# Altium project Sayma_mezzanine.PrjPCB
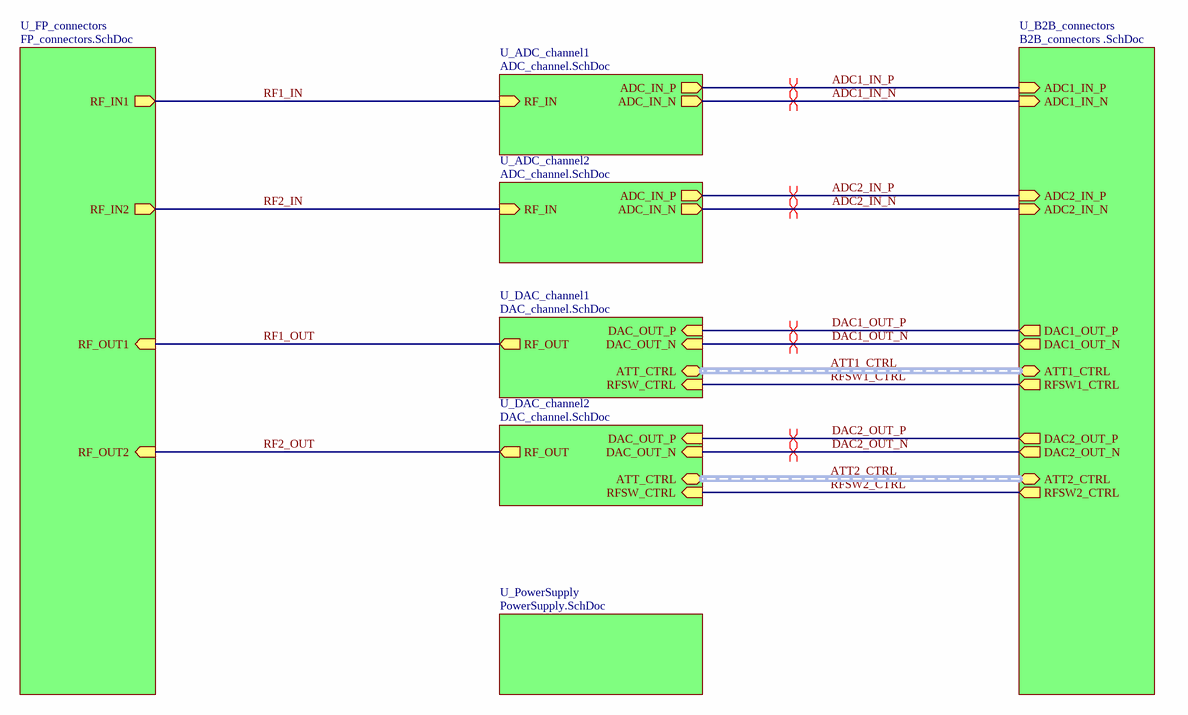
[diagram p0: Sayma_mezz_top.SchDoc]
7 sheets, 41 parts. Net scope: hierarchical (ports join the sheet entries above them; power ports are global).
Sheets:
  Sayma_mezz_top.SchDoc
    U_DAC_channel1 = DAC_channel.SchDoc
      U_Amplifier = Amplifier.SchDoc
      U_DAC_Filter = DAC_Filter.SchDoc
    U_DAC_channel2 = DAC_channel.SchDoc
      U_Amplifier = Amplifier.SchDoc
      U_DAC_Filter = DAC_Filter.SchDoc
    U_B2B_connectors = B2B_connectors .SchDoc
  ADC_Buffer.SchDoc
  ADC_Filter.SchDoc

## Sheet Sayma_mezz_top.SchDoc: =ProjectName
size 420 x 297 mm; Author: SBH; CompanyName: WUT; DrawnBy: SBH; Organization: ISE-WUT; Address1: Warsaw Univeristy of Technology; Address2: Nowowiejska 15/19; Revision: -; SheetNumber: -; SheetTotal: -; EDA_Number: ARTIQ; Projet: Sayma_Mezzanine; ModifiedBy: -; CreateDate: XX/XX/XXXX; CheckedDate: -; Title2: Sayma_mezz_top.SchDoc; DivGrp: ISE; Designer: SBH; ModifiedDate: -; ProjectName: Sayma_Mezzanine

### Sub-sheets
U_ADC_channel1 = ADC_channel.SchDoc (file not in this document): ADC_IN_N (out), ADC_IN_P (out), RF_IN (in)
U_ADC_channel2 = ADC_channel.SchDoc (file not in this document): ADC_IN_P (out), ADC_IN_N (out), RF_IN (in)
U_B2B_connectors = B2B_connectors .SchDoc: ADC1_IN_N (in), ADC1_IN_P (in), DAC1_OUT_N (out), DAC1_OUT_P (out), DAC2_OUT_N (out), DAC2_OUT_P (out), ADC2_IN_N (in), ADC2_IN_P (in), ATT1_CTRL (harness ATT_CTRL), ATT2_CTRL (harness ATT_CTRL), RFSW1_CTRL (out), RFSW2_CTRL (out)
U_DAC_channel1 = DAC_channel.SchDoc: DAC_OUT_P (in), DAC_OUT_N (in), RF_OUT (out), ATT_CTRL (harness ATT_CTRL), RFSW_CTRL (in)
U_DAC_channel2 = DAC_channel.SchDoc: DAC_OUT_P (in), DAC_OUT_N (in), RF_OUT (out), RFSW_CTRL (in), ATT_CTRL (harness ATT_CTRL)
U_FP_connectors = FP_connectors.SchDoc (file not in this document): RF_IN1 (out), RF_IN2 (out), RF_OUT1 (in), RF_OUT2 (in)
U_PowerSupply = PowerSupply.SchDoc (file not in this document): no entries

### Nets
ADC1_IN_N: sheet U_ADC_channel1/ADC_IN_N, sheet U_B2B_connectors/ADC1_IN_N
ADC1_IN_P: sheet U_ADC_channel1/ADC_IN_P, sheet U_B2B_connectors/ADC1_IN_P
ADC2_IN_N: sheet U_ADC_channel2/ADC_IN_N, sheet U_B2B_connectors/ADC2_IN_N
ADC2_IN_P: sheet U_ADC_channel2/ADC_IN_P, sheet U_B2B_connectors/ADC2_IN_P
DAC1_OUT_N: sheet U_DAC_channel1/DAC_OUT_N, sheet U_B2B_connectors/DAC1_OUT_N
DAC1_OUT_P: sheet U_DAC_channel1/DAC_OUT_P, sheet U_B2B_connectors/DAC1_OUT_P
DAC2_OUT_N: sheet U_DAC_channel2/DAC_OUT_N, sheet U_B2B_connectors/DAC2_OUT_N
DAC2_OUT_P: sheet U_DAC_channel2/DAC_OUT_P, sheet U_B2B_connectors/DAC2_OUT_P
RF1_IN: sheet U_ADC_channel1/RF_IN, sheet U_FP_connectors/RF_IN1
RF1_OUT: sheet U_DAC_channel1/RF_OUT, sheet U_FP_connectors/RF_OUT1
RF2_IN: sheet U_ADC_channel2/RF_IN, sheet U_FP_connectors/RF_IN2
RF2_OUT: sheet U_DAC_channel2/RF_OUT, sheet U_FP_connectors/RF_OUT2
RFSW1_CTRL: sheet U_DAC_channel1/RFSW_CTRL, sheet U_B2B_connectors/RFSW1_CTRL
RFSW2_CTRL: sheet U_DAC_channel2/RFSW_CTRL, sheet U_B2B_connectors/RFSW2_CTRL

### Buses and harness runs
harness ATT1_CTRL = sheet U_B2B_connectors/ATT1_CTRL = sheet U_DAC_channel1/ATT_CTRL
harness ATT2_CTRL = sheet U_B2B_connectors/ATT2_CTRL = sheet U_DAC_channel2/ATT_CTRL

### Layout directives
differential pair: ADC1_IN_N, ADC1_IN_P, ADC2_IN_N, ADC2_IN_P, DAC1_OUT_N, DAC1_OUT_P, DAC2_OUT_N, DAC2_OUT_P

### Notes on the sheet
- Project/Equipment
- Designer
- Drawn by
- Check.by
- File
- Last Mod.
- Print Date
- Sheet
- Size
- A3
- of
- Rev

## Sheet DAC_channel.SchDoc: =ProjectName
size 420 x 297 mm; Author: SBH; CompanyName: WUT; DrawnBy: SBH; Organization: ISE-WUT; Address1: Warsaw Univeristy of Technology; Address2: Nowowiejska 15/19; Revision: -; SheetNumber: -; SheetTotal: -; EDA_Number: ARTIQ; Projet: ADC/DAC MEZZANINE; ModifiedBy: -; CreateDate: XX/XX/XXXX; CheckedDate: -; Title2: DAC_channel.SchDoc; DivGrp: ISE; Designer: SBH; ModifiedDate: -; ProjectName: ADC/DAC MEZZANINE
Used 2 times, as channels U_DAC_channel1, U_DAC_channel2. Parts and nets are listed once, with the designators drawn on the sheet.
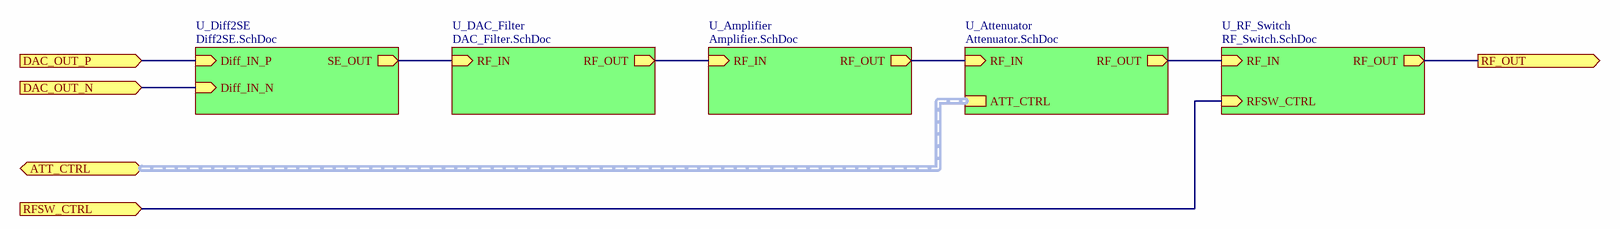
[diagram p1: DAC_channel.SchDoc]

### Sub-sheets
U_Amplifier = Amplifier.SchDoc: RF_IN (in), RF_OUT (out)
U_Attenuator = Attenuator.SchDoc (file not in this document): RF_IN (in), RF_OUT (out), ATT_CTRL (harness ATT_CTRL)
U_DAC_Filter = DAC_Filter.SchDoc: RF_IN (in), RF_OUT (out)
U_Diff2SE = Diff2SE.SchDoc (file not in this document): Diff_IN_P (in), Diff_IN_N (in), SE_OUT (out)
U_RF_Switch = RF_Switch.SchDoc (file not in this document): RF_IN (in), RF_OUT (out), RFSW_CTRL (in)

### Ports
ATT_CTRL (harness ATT_CTRL), DAC_OUT_N (in), DAC_OUT_P (in), RF_OUT (out), RFSW_CTRL (in)

### Nets
DAC_OUT_N: port DAC_OUT_N, sheet U_Diff2SE/Diff_IN_N
DAC_OUT_P: port DAC_OUT_P, sheet U_Diff2SE/Diff_IN_P
RF_OUT: port RF_OUT, sheet U_RF_Switch/RF_OUT
RFSW_CTRL: port RFSW_CTRL, sheet U_RF_Switch/RFSW_CTRL
(unnamed): sheet U_Diff2SE/SE_OUT, sheet U_DAC_Filter/RF_IN
(unnamed): sheet U_Amplifier/RF_IN, sheet U_DAC_Filter/RF_OUT
(unnamed): sheet U_Amplifier/RF_OUT, sheet U_Attenuator/RF_IN
(unnamed): sheet U_Attenuator/RF_OUT, sheet U_RF_Switch/RF_IN

### Channels
U_DAC_channel1: ports DAC_OUT_N=DAC1_OUT_N DAC_OUT_P=DAC1_OUT_P RF_OUT=RF1_OUT RFSW_CTRL=RFSW1_CTRL
U_DAC_channel2: ports DAC_OUT_N=DAC2_OUT_N DAC_OUT_P=DAC2_OUT_P RF_OUT=RF2_OUT RFSW_CTRL=RFSW2_CTRL

### Buses and harness runs
harness port ATT_CTRL = sheet U_Attenuator/ATT_CTRL

### Notes on the sheet
- Project/Equipment
- Designer
- Drawn by
- Check.by
- File
- Last Mod.
- Print Date
- Sheet
- Size
- A3
- of
- Rev

## Sheet Amplifier.SchDoc: =ProjectName
size 420 x 297 mm; Author: SBH; CompanyName: WUT; DrawnBy: SBH; Organization: ISE-WUT; Address1: Warsaw Univeristy of Technology; Address2: Nowowiejska 15/19; Revision: -; SheetNumber: -; SheetTotal: -; EDA_Number: ARTIQ; Projet: ADC/DAC MEZZANINE; ModifiedBy: -; CreateDate: XX/XX/XXXX; CheckedDate: -; Title2: Amplifier.SchDoc; DivGrp: ISE; Designer: SBH; ModifiedDate: -; ProjectName: ADC/DAC MEZZANINE
Used 2 times, as channels U_DAC_channel1/U_Amplifier, U_DAC_channel2/U_Amplifier. Parts and nets are listed once, with the designators drawn on the sheet.
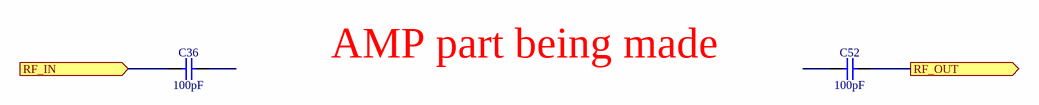
[diagram p2: Amplifier.SchDoc]

### Parts
C36  100pF  [CAPC1005X55N]
C52  100pF  [CAPC1005X55N]

### Ports
RF_IN (in), RF_OUT (out)

### Nets
RF_IN: C36.2 ; port RF_IN
RF_OUT: C52.1 ; port RF_OUT

Not connected (* = marked no-connect by the designer): C36 1; C52 2

### Channels
U_DAC_channel1/U_Amplifier: designators end in A; ports RF_IN=NetC36A_2 RF_OUT=NetC52A_1
U_DAC_channel2/U_Amplifier: designators end in B; ports RF_IN=NetC36B_2 RF_OUT=NetC52B_1

### Notes on the sheet
- AMP part being made
- Project/Equipment
- Designer
- Drawn by
- Check.by
- File
- Last Mod.
- Print Date
- Sheet
- Size
- A3
- of
- Rev

### Library data of the parts
C36 C52 = CC0402_100PF_50V_5%_C0G: Non-polarised capacitor; Part Description: SMD Multilayer Chip Ceramic Capacitor; Manufacturer: GENERIC; Manufacturer1 Part Number: C0402C101J5GACTU; Voltage: 50V; TC: C0G/NP0; Tolerance: ±5%; Part Number: CC0402_100PF_50V_5%_C0G; Component Kind: Standard; Component Type: Standard; Pin Count: 2; Value: 100pF; Status: Preferred; Manufacturer Part Number: CC0402_100PF_50V_5%_C0G; Case: 0402; Mounted: Yes; Socket: No; SMD: Yes; Sense: No; Manufacturer1 Example: KEMET; Manufacturer1 ComponentHeight: 0.55mm; HelpURL: \\cern.ch\dfs\Applications\Altium\Datasheets\CC0805_C0G_KEMET_(Commercial Grade).pdf; Author: CERN DEM JLC; CreateDate: 2007-12-03; LatestRevisionDate: 2015-04-22

## Sheet DAC_Filter.SchDoc: =ProjectName
size 420 x 297 mm; Author: SBH; CompanyName: WUT; DrawnBy: SBH; Organization: ISE-WUT; Address1: Warsaw Univeristy of Technology; Address2: Nowowiejska 15/19; Revision: -; SheetNumber: -; SheetTotal: -; EDA_Number: ARTIQ; Projet: ADC/DAC MEZZANINE; ModifiedBy: -; CreateDate: XX/XX/XXXX; CheckedDate: -; Title2: DAC_Filter.SchDoc; DivGrp: ISE; Designer: SBH; ModifiedDate: -; ProjectName: ADC/DAC MEZZANINE
Used 2 times, as channels U_DAC_channel1/U_DAC_Filter, U_DAC_channel2/U_DAC_Filter. Parts and nets are listed once, with the designators drawn on the sheet.
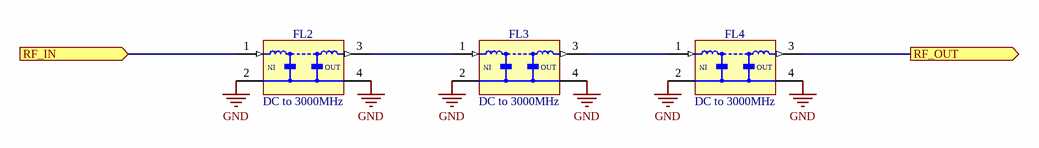
[diagram p3: DAC_Filter.SchDoc]

### Parts
FL2  DC to 3000MHz  [FIL_MINI-CIRCUITS_FV1206]
FL3  DC to 3000MHz  [FIL_MINI-CIRCUITS_FV1206]
FL4  DC to 3000MHz  [FIL_MINI-CIRCUITS_FV1206]

### Ports
RF_IN (in), RF_OUT (out)

### Nets
GND: FL2.2(GND) FL2.4(GND) FL3.2(GND) FL3.4(GND) FL4.2(GND) FL4.4(GND)
RF_IN: FL2.1(RFIN) ; port RF_IN
RF_OUT: FL4.3(RFOUT) ; port RF_OUT
NetFL2_3: FL2.3(RFOUT) FL3.1(RFIN)
NetFL3_3: FL3.3(RFOUT) FL4.1(RFIN)

### Channels
U_DAC_channel1/U_DAC_Filter: designators end in A; ports RF_IN=NetFL2A_1 RF_OUT=NetC36A_2
U_DAC_channel2/U_DAC_Filter: designators end in B; ports RF_IN=NetFL2B_1 RF_OUT=NetC36B_2

### Notes on the sheet
- Project/Equipment
- Designer
- Drawn by
- Check.by
- File
- Last Mod.
- Print Date
- Sheet
- Size
- A3
- of
- Rev
- (in symbol FIL_MINI-CIRCUITS_LFCN-3000+) IN; OUT

### Library data of the parts
FL2-FL4 = FIL_MINI-CIRCUITS_LFCN-3000+: 50 Ohm DC to 3000MHz Low Pass Filter; Part Description: 50 Ohm Low Pass Filter; Part Number: FIL_MINI-CIRCUITS_LFCN-3000+; Component Kind: Standard; Component Type: Standard; Pin Count: 2; Value: DC to 3000MHz; Status: None; Manufacturer: MINI-CIRCUITS; Manufacturer Part Number: LFCN-3000+; Mounted: Yes; Socket: No; SMD: Yes; Sense: No; ComponentHeight: 0.94mm; HelpURL: \\cern.ch\dfs\Applications\Altium\Datasheets\FIL_MINI-CIRCUITS_LFCN-3000+.pdf; Author: CERN DEM JLC; CreateDate: 2013-12-09; LatestRevisionDate: 2013-12-09

## Sheet B2B_connectors .SchDoc: =ProjectName
size 420 x 297 mm; Author: SBH; CompanyName: WUT; DrawnBy: SBH; Organization: ISE-WUT; Address1: Warsaw Univeristy of Technology; Address2: Nowowiejska 15/19; Revision: -; SheetNumber: -; SheetTotal: -; EDA_Number: ARTIQ; Projet: ADC/DAC MEZZANINE; ModifiedBy: -; CreateDate: XX/XX/XXXX; CheckedDate: -; Title2: B2B_connectors .SchDoc; DivGrp: ISE; Designer: SBH; ModifiedDate: -; ProjectName: ADC/DAC MEZZANINE
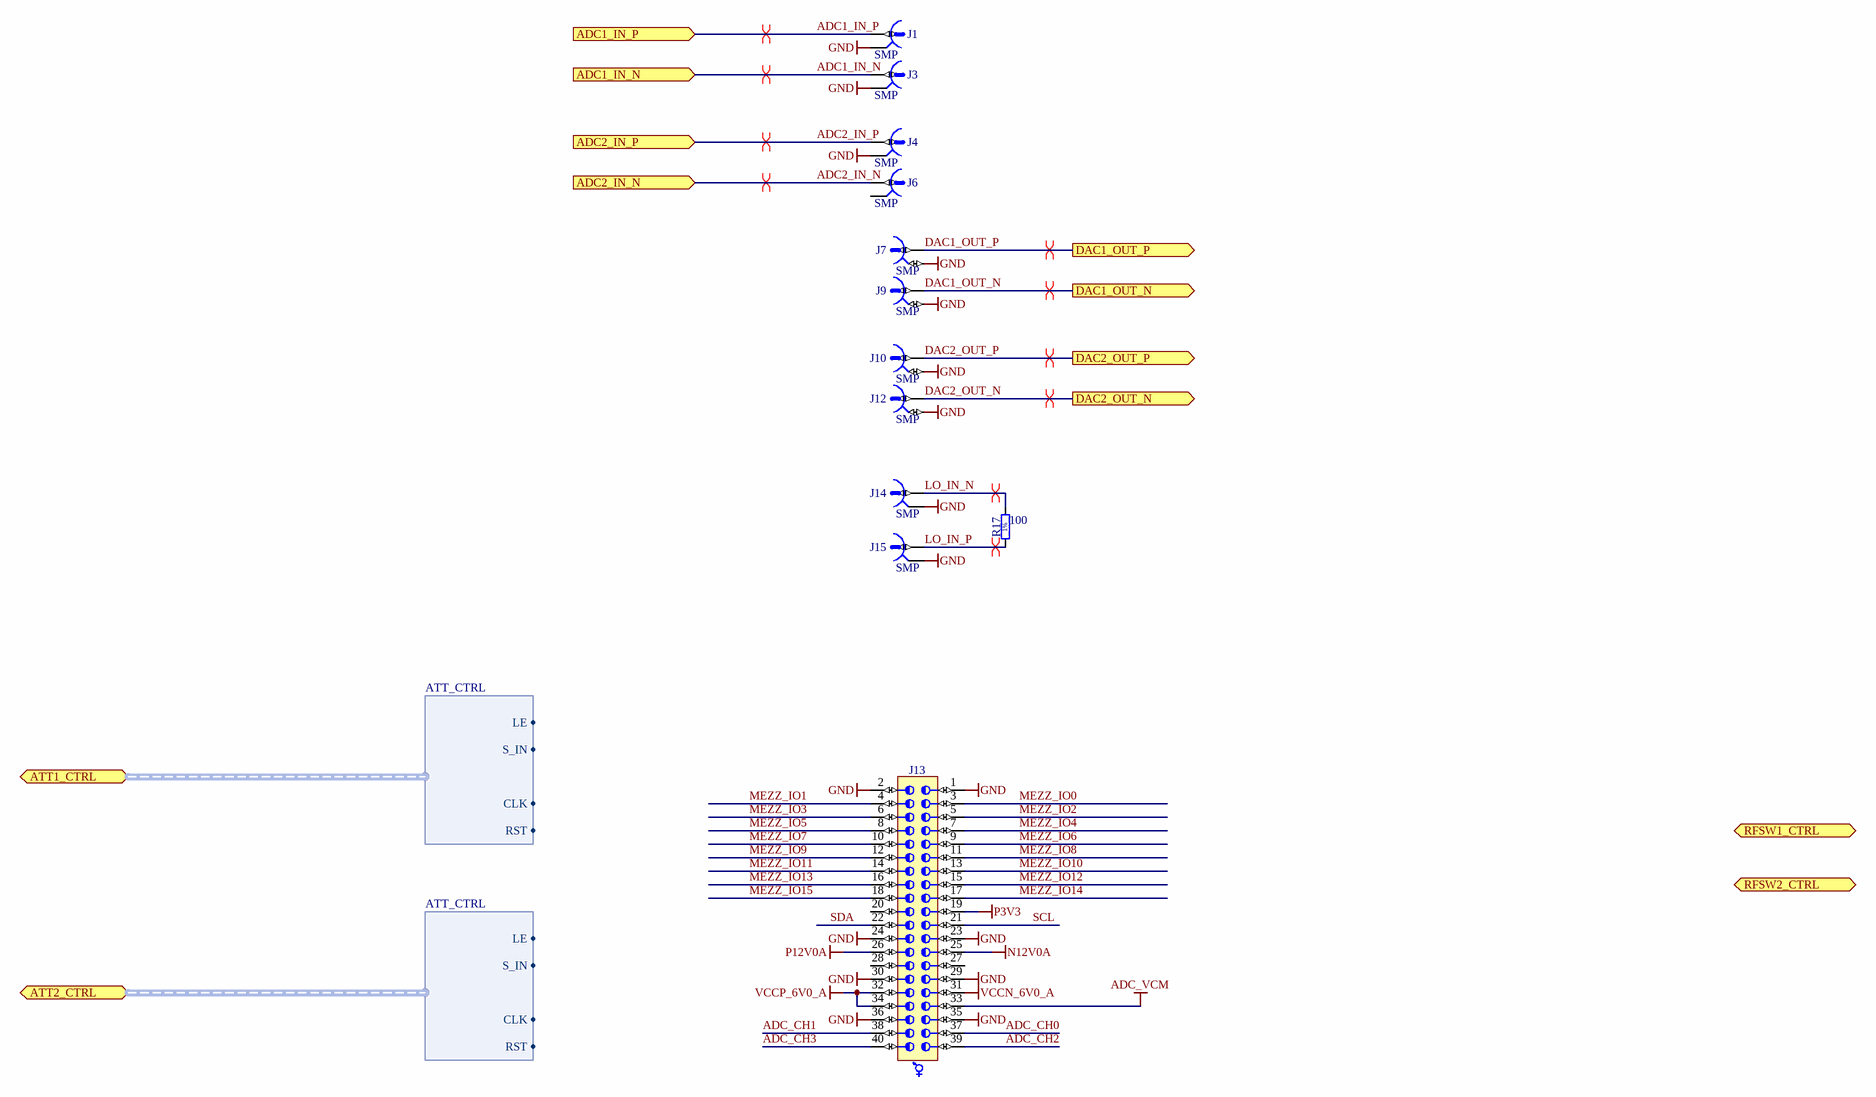
[diagram p4: B2B_connectors .SchDoc]

### Parts
J1  SMP  [AMPHENOL_SMP-MSLD-PCT-10]
J3  SMP  [AMPHENOL_SMP-MSLD-PCT-10]
J4  SMP  [AMPHENOL_SMP-MSLD-PCT-10]
J6  SMP  [AMPHENOL_SMP-MSLD-PCT-10]
J7  SMP  [MOLEX_85305-0232]
J9  SMP  [MOLEX_85305-0232]
J10  SMP  [MOLEX_85305-0232]
J12  SMP  [MOLEX_85305-0232]
J13  (no value)  [SAMTEC_LSS-120-03-L-DV-A]
J14  SMP  [AMPHENOL_SMP-MSLD-PCT-10]
J15  SMP  [AMPHENOL_SMP-MSLD-PCT-10]
R17  100  [RESC1005X40N]

### Ports
ADC1_IN_N (in), ADC1_IN_P (in), ADC2_IN_N (in), ADC2_IN_P (in), ATT1_CTRL (harness ATT_CTRL), ATT2_CTRL (harness ATT_CTRL), DAC1_OUT_N (out), DAC1_OUT_P (out), DAC2_OUT_N (out), DAC2_OUT_P (out), RFSW1_CTRL (out), RFSW2_CTRL (out)

### Harnesses
ATT_CTRL: LE, S_IN, CLK, RST

### Nets
ADC_VCM: J13.33
GND: J1.2 J3.2 J4.2 J7.2 J9.2 J10.2 J12.2 J13.1 J13.2 J13.23 J13.24 J13.29 J13.30 J13.35 J13.36 J14.2 J15.2
N12V0A: J13.25
P3V3: J13.19
P12V0A: J13.26
VCCN_6V0_A: J13.31
VCCP_6V0_A: J13.32 J13.34
ADC1_IN_N: J3.1 ; port ADC1_IN_N
ADC1_IN_P: J1.1 ; port ADC1_IN_P
ADC2_IN_N: J6.1 ; port ADC2_IN_N
ADC2_IN_P: J4.1 ; port ADC2_IN_P
ADC_CH0: J13.37
ADC_CH1: J13.38
ADC_CH2: J13.39
ADC_CH3: J13.40
DAC1_OUT_N: J9.1 ; port DAC1_OUT_N
DAC1_OUT_P: J7.1 ; port DAC1_OUT_P
DAC2_OUT_N: J12.1 ; port DAC2_OUT_N
DAC2_OUT_P: J10.1 ; port DAC2_OUT_P
LO_IN_N: J14.1 R17.2
LO_IN_P: J15.1 R17.1
MEZZ_IO0: J13.3
MEZZ_IO1: J13.4
MEZZ_IO2: J13.5
MEZZ_IO3: J13.6
MEZZ_IO4: J13.7
MEZZ_IO5: J13.8
MEZZ_IO6: J13.9
MEZZ_IO7: J13.10
MEZZ_IO8: J13.11
MEZZ_IO9: J13.12
MEZZ_IO10: J13.13
MEZZ_IO11: J13.14
MEZZ_IO12: J13.15
MEZZ_IO13: J13.16
MEZZ_IO14: J13.17
MEZZ_IO15: J13.18
SCL: J13.21
SDA: J13.22

Not connected (* = marked no-connect by the designer): J6 2; J13 20 27 28

### Layout directives
differential pair: ADC1_IN_N, ADC1_IN_P, ADC2_IN_N, ADC2_IN_P, DAC1_OUT_N, DAC1_OUT_P, DAC2_OUT_N, DAC2_OUT_P, LO_IN_N, LO_IN_P

### Notes on the sheet
- Project/Equipment
- Designer
- Drawn by
- Check.by
- File
- Last Mod.
- Print Date
- Sheet
- Size
- A3
- of
- Rev
- (in symbol R0402_100R_1%_0.0625W_100PPM) 1%

### Library data of the parts
J1 J3 J4 J6 J14 J15 = CON_SMP-MSLD-PCT-10: 50 Ohms, SMP Surface/THT Mount Plug, Limited Detent; Part Description: 50 Ohms, SMP Surface Mount Plug, Limited Detent; Manufacturer: AMPHENOL; PressFit: No; Part Number: AMPHENOL_SMP-MSLD-PCT-10; Component Kind: Standard; Component Type: Standard; Pin Count: 2; Family: SMP; Mounted: Yes; Socket: No; SMD: No; Sense: No; Status: None; Manufacturer Part Number: SMP-MSLD-PCT-10; ComponentHeight: 4.1mm; HelpURL: \\cern.ch\dfs\Applications\Altium\Datasheets\MOLEX_85305-0232.pdf; Author: GK; CreateDate: 11.11.2016; LatestRevisionDate: 11.11.2016
J7 J9 J10 J12 = MOLEX_85305-0232: Part Description: 50 Ohms, SMP Surface Mount Plug, Limited Detent; Manufacturer: MOLEX; PressFit: No; Part Number: MOLEX_85305-0232; Component Kind: Standard; Component Type: Standard; Pin Count: 2; Family: SMP; Mounted: Yes; Socket: No; SMD: Yes; Sense: No; Status: None; Manufacturer Part Number: 85305-0232; ComponentHeight: 4.1mm; HelpURL: \\cern.ch\dfs\Applications\Altium\Datasheets\MOLEX_85305-0232.pdf; Author: CERN DEM JMW; CreateDate: 09.08.2016; LatestRevisionDate: 09.08.2016
J13 = SAMTEC_LSS-120-03-L-DV-A: Connector 40 Hermaphroditic; Part Description: 40 Contacts, Pitch 0.635mm, Razor Beam LSS Vertical High Speed Hermaphroditic Strip (Lead Style 5.49mm); Manufacturer: SAMTEC; PressFit: No; Part Number: SAMTEC_LSS-120-03-L-DV-A; Component Kind: Standard; Component Type: Standard; Pin Count: 40; Mounted: Yes; Socket: No; Sense: No; SMD: Yes; Status: None; Manufacturer Part Number: LSS-120-03-L-DV-A; ComponentHeight: 5.57mm; HelpURL: \\cern.ch\dfs\Applications\Altium\Datasheets\SAMTEC_LSS-120-03-L-DV-A.pdf; Author: CERN DEM JMW; CreateDate: 10.11.2015; LatestRevisionDate: 10.11.2015
R17 = R0402_100R_1%_0.0625W_100PPM: Resistor - 1%; Part Description: General Purpose Thick Film Chip Resistor; Manufacturer: GENERIC; Manufacturer1 Part Number: 232270671001L; TC: ±100ppm/°C; Part Number: R0402_100R_1%_0.0625W_100PPM; Component Kind: Standard; Component Type: Standard; Pin Count: 2; Value: 100; Status: Not recommended; Power: 0.0625W; Tolerance: ±1%; Manufacturer Part Number: R0402_100R_1%_0.0625W_100PPM; Case: 0402; Mounted: Yes; Sense: No; Socket: No; SMD: Yes; Manufacturer1 Example: YAGEO PHYCOMP; Manufacturer1 ComponentHeight: 0.4mm; HelpURL: \\cern.ch\dfs\Applications\Altium\Datasheets\R0402_Phycomp_RC0402.pdf; Author: CERN DEM JLC; CreateDate: 03.12.2007; LatestRevisionDate: 17.10.2012

## Sheet ADC_Buffer.SchDoc: =ProjectName
size 420 x 297 mm; Author: SBH; CompanyName: WUT; DrawnBy: SBH; Organization: ISE-WUT; Address1: Warsaw Univeristy of Technology; Address2: Nowowiejska 15/19; Revision: -; SheetNumber: -; SheetTotal: -; EDA_Number: ARTIQ; Projet: ADC/DAC MEZZANINE; ModifiedBy: -; CreateDate: XX/XX/XXXX; CheckedDate: -; Title2: ADC_Buffer.SchDoc; DivGrp: ISE; Designer: SBH; ModifiedDate: -; ProjectName: ADC/DAC MEZZANINE
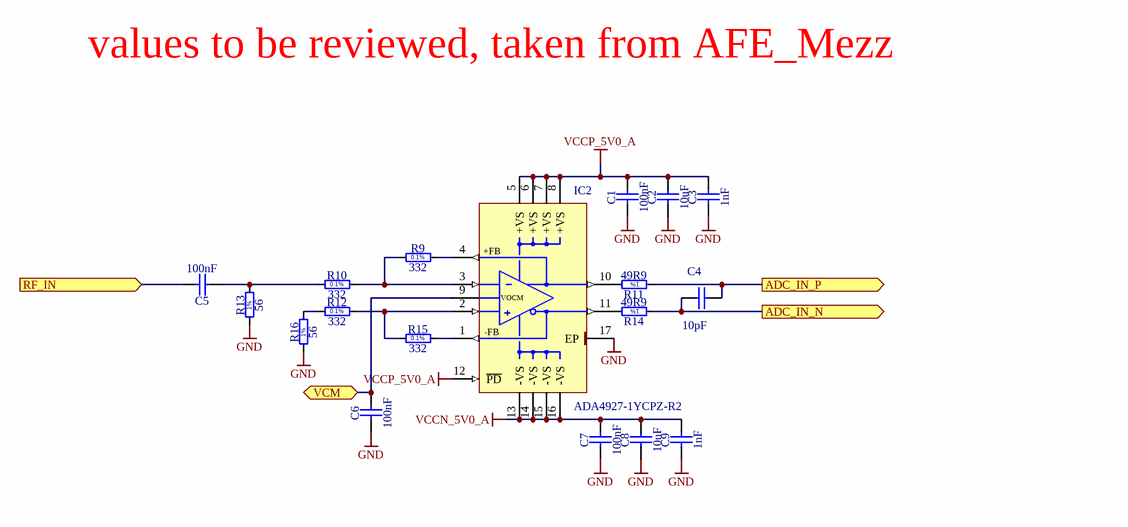
[diagram p5: ADC_Buffer.SchDoc]

### Parts
C1  100nF  [CAPC1005X55N]
C2  10uF  [CAPC1608X87N]
C3  1nF  [CAPC1005X55N]
C4  10pF  [CAPC1608X87N]
C5  100nF  [CAPC1005X55N]
C6  100nF  [CAPC1005X55N]
C7  100nF  [CAPC1005X55N]
C8  10uF  [CAPC1608X87N]
C9  1nF  [CAPC1005X55N]
IC2  ADA4927-1YCPZ-R2  [QFN50P300X300X100-17N-S145]
R9  332  [RESC1608X55N]
R10  332  [RESC1608X55N]
R11  49R9  [RESC1005X40N]
R12  332  [RESC1608X55N]
R13  56  [RESC1005X40N]
R14  49R9  [RESC1005X40N]
R15  332  [RESC1608X55N]
R16  56  [RESC1005X40N]

### Ports
ADC_IN_N (out), ADC_IN_P (out), RF_IN (in), VCM (bidir)

### Nets
GND: C1.1 C2.1 C3.1 C6.1 C7.1 C8.1 C9.1 IC2.17(EP) R13.1 R16.1
VCCN_5V0_A: C7.2 C8.2 C9.2 IC2.13(-VS) IC2.14(-VS) IC2.15(-VS) IC2.16(-VS)
VCCP_5V0_A: C1.2 C2.2 C3.2 IC2.5(+VS) IC2.6(+VS) IC2.7(+VS) IC2.8(+VS) IC2.12(~{PD})
NetC4_1: C4.1 R14.1 ; port ADC_IN_N
NetC4_2: C4.2 R11.1 ; port ADC_IN_P
NetC5_1: C5.1 R10.1 R13.2
NetC5_2: C5.2 ; port RF_IN
NetC6_2: C6.2 IC2.9(VOCM) ; port VCM
NetIC2_1: IC2.1(-FB) R15.2
NetIC2_2: IC2.2(+IN) R12.2 R15.1
NetIC2_3: IC2.3(-IN) R9.1 R10.2
NetIC2_4: IC2.4(+FB) R9.2
NetIC2_10: IC2.10(+OUT) R11.2
NetIC2_11: IC2.11(-OUT) R14.2
NetR12_1: R12.1 R16.2

### Notes on the sheet
- values to be reviewed, taken from AFE_Mezz
- Project/Equipment
- Designer
- Drawn by
- Check.by
- File
- Last Mod.
- Print Date
- Sheet
- Size
- A3
- of
- Rev
- (in symbol R0402_49R9_1%_0.0625W_100PPM) 1%
- (in symbol R0402_56R_1%_0.0625W_100PPM) 1%
- (in symbol R0603_332R_0.1%_0.063W_10PPM) 0.1%

### Library data of the parts
C1 C5-C7 = CC0402_100NF_16V_10%_X5R: Non-polarised capacitor; Part Description: SMD Multilayer Chip Ceramic Capacitor; Manufacturer: GENERIC; Manufacturer1 Part Number: GRM155R61C104KA88D; Voltage: 16V; TC: X5R; Tolerance: ±10%; Part Number: CC0402_100NF_16V_10%_X5R; Component Kind: Standard; Component Type: Standard; Pin Count: 2; Value: 100nF; Status: None; Manufacturer Part Number: CC0402_100NF_16V_10%_X5R; Case: 0402; Mounted: Yes; Socket: No; SMD: Yes; Sense: No; Manufacturer1 Example: MURATA; Manufacturer1 ComponentHeight: 0.55mm; HelpURL: \\cern.ch\dfs\Applications\Altium\Datasheets\CC0402_X5R_MURATA_GRM.pdf; Author: CERN DEM JLC; CreateDate: 10.12.2013; LatestRevisionDate: 10.12.2013
C2 C8 = CC0603_10UF_6.3V_20%_X5R: Non-polarised capacitor; Part Description: SMD Multilayer Chip Ceramic Capacitor; Manufacturer: GENERIC; Manufacturer1 Part Number: C0603C106M9PAC; Voltage: 6.3V; TC: X5R; Tolerance: ±20%; Part Number: CC0603_10UF_6.3V_20%_X5R; Component Kind: Standard; Component Type: Standard; Pin Count: 2; Value: 10uF; Status: Preferred; Manufacturer Part Number: CC0603_10uF_6.3V_20%_X5R; Case: 0603; Mounted: Yes; Socket: No; SMD: Yes; Sense: No; Manufacturer1 Example: KEMET; Manufacturer1 ComponentHeight: 0.95mm; HelpURL: \\cern.ch\dfs\Applications\Altium\Datasheets\CC0603_X5R_KEMET.pdf; Author: CERN DEM JLC; CreateDate: 03.12.2007; LatestRevisionDate: 03.12.2007
C3 C9 = CC0402_1NF_50V_10%_X7R: Non-polarised capacitor; Part Description: SMD Multilayer Chip Ceramic Capacitor; Manufacturer: GENERIC; Manufacturer1 Part Number: 223858715623; Voltage: 50V; TC: X7R; Tolerance: ±10%; Part Number: CC0402_1NF_50V_10%_X7R; Component Kind: Standard; Component Type: Standard; Pin Count: 2; Value: 1nF; Status: Not Recommended; Manufacturer Part Number: CC0402_1NF_50V_10%_X7R; Case: 0402; Mounted: Yes; Socket: No; SMD: Yes; Sense: No; Manufacturer1 Example: PHYCOMP; Manufacturer1 ComponentHeight: 0.55mm; HelpURL: \\cern.ch\dfs\Applications\Altium\Datasheets\CC0402_X7R_PHYCOMP.pdf; Author: CERN DEM JLC; CreateDate: 03.12.2007; LatestRevisionDate: 03.12.2007
C4 = CC0603_10PF_50V_5%_NP0: Non-polarised capacitor; Part Description: SMD Multilayer Chip Ceramic Capacitor; Manufacturer: GENERIC; Manufacturer1 Part Number: 223886715109; Voltage: 50V; TC: C0G/NP0; Tolerance: ±5%; Part Number: CC0603_10PF_50V_5%_NP0; Component Kind: Standard; Component Type: Standard; Pin Count: 2; Value: 10pF; Status: Preferred; Manufacturer Part Number: CC0603_10PF_50V_5%_NP0; Case: 0603; Mounted: Yes; Socket: No; SMD: Yes; Sense: No; Manufacturer1 Example: PHYCOMP; Manufacturer1 ComponentHeight: 0.87mm; HelpURL: \\cern.ch\dfs\Applications\Altium\Datasheets\CC0603_NP0_PHYCOMP.pdf; Author: CERN DEM JLC; CreateDate: 03.12.2007; LatestRevisionDate: 03.12.2007
IC2 = ADA4927-1YCPZ-R2: Ultralow Distortion Current Feedback Differential ADC Driver; Manufacturer: ANALOG DEVICES; PressFit: No; Bonding: No; Part Number: ADA4927-1YCPZ-R2; Component Kind: Standard; Component Type: Standard; Device: ADA4927-1YCPZ-R2; PackageDescription: QFN,0.50mm pitch,square; 4 pin X 4 pin, 3mm X 3mm X 1.00mm H body (w/thermal tab 1.45 X 1.45mm),  IPC Medium Density; Part Description: Ultralow Distortion Current Feedback Differential ADC Driver; Manufacturer Part Number: ADA4927-1YCPZ-R2; Pin Count: 17; Case: QFN16; Mounted: Yes; Socket: No; SMD: Yes; Sense: No; ComponentHeight: 1mm; Author: CERN DEM JLC; HelpURL: \\cern.ch\dfs\Applications\Altium\Datasheets\ADA4927-1YCPZ-R2.pdf; CreateDate: 19.04.2010; LatestRevisionDate: 19.04.2010
R9 R10 R12 R15 = R0603_332R_0.1%_0.063W_10PPM: Resistor - 0.1%; Part Description: Thin Film Chip Resistor; Manufacturer: GENERIC; Manufacturer1 Part Number: RN73C1J332RBTDF; Power: 0.063W; TC: ±10ppm; Part Number: R0603_332R_0.1%_0.063W_10PPM; Component Kind: Standard; Component Type: Standard; Pin Count: 2; Value: 332; Status: Not recommended; Tolerance: ±0.1%; Manufacturer Part Number: R0603_332R_0.1%_0.063W_10PPM; Case: 0603; Mounted: Yes; Sense: No; Socket: No; SMD: Yes; Manufacturer1 Example: TYCO HOLSWORTHY; Manufacturer1 ComponentHeight: 0.5mm; HelpURL: \\cern.ch\dfs\Applications\Altium\Datasheets\R0603_Tyco_RN73.pdf; Author: CERN DEM JLC; CreateDate: 03.12.2007; LatestRevisionDate: 13.03.2008
R11 R14 = R0402_49R9_1%_0.0625W_100PPM: Resistor - 1%; Part Description: General Purpose Thick Film Chip Resistor; Manufacturer: GENERIC; Manufacturer1 Part Number: 232270674999L or RC0402FR-0749R9L; TC: ±100ppm/°C; Part Number: R0402_49R9_1%_0.0625W_100PPM; Component Kind: Standard; Component Type: Standard; Pin Count: 2; Value: 49R9; Status: Not recommended; Power: 0.0625W; Tolerance: ±1%; Manufacturer Part Number: R0402_49R9_1%_0.0625W_100PPM; Case: 0402; Mounted: Yes; Sense: No; Socket: No; SMD: Yes; Manufacturer1 Example: YAGEO PHYCOMP; Manufacturer1 ComponentHeight: 0.4mm; HelpURL: \\cern.ch\dfs\Applications\Altium\Datasheets\R0402_Phycomp_RC0402.pdf; Author: CERN DEM JLC; CreateDate: 24.10.2012; LatestRevisionDate: 24.10.2012
R13 R16 = R0402_56R_1%_0.0625W_100PPM: Resistor - 1%; Part Description: General Purpose Thick Film Chip Resistor; Manufacturer: GENERIC; Manufacturer1 Part Number: 232270675609L; TC: ±100ppm/°C; Part Number: R0402_56R_1%_0.0625W_100PPM; Component Kind: Standard; Component Type: Standard; Pin Count: 2; Value: 56; Status: Not recommended; Power: 0.0625W; Tolerance: ±1%; Manufacturer Part Number: R0402_56R_1%_0.0625W_100PPM; Case: 0402; Mounted: Yes; Sense: No; Socket: No; SMD: Yes; Manufacturer1 Example: YAGEO PHYCOMP; Manufacturer1 ComponentHeight: 0.4mm; HelpURL: \\cern.ch\dfs\Applications\Altium\Datasheets\R0402_Phycomp_RC0402.pdf; Author: CERN DEM JLC; CreateDate: 03.12.2007; LatestRevisionDate: 17.10.2012

## Sheet ADC_Filter.SchDoc: =ProjectName
size 420 x 297 mm; Author: SBH; CompanyName: WUT; DrawnBy: SBH; Organization: ISE-WUT; Address1: Warsaw Univeristy of Technology; Address2: Nowowiejska 15/19; Revision: -; SheetNumber: -; SheetTotal: -; EDA_Number: ARTIQ; Projet: ADC/DAC MEZZANINE; ModifiedBy: -; CreateDate: XX/XX/XXXX; CheckedDate: -; Title2: ADC_Filter.SchDoc; DivGrp: ISE; Designer: SBH; ModifiedDate: -; ProjectName: ADC/DAC MEZZANINE
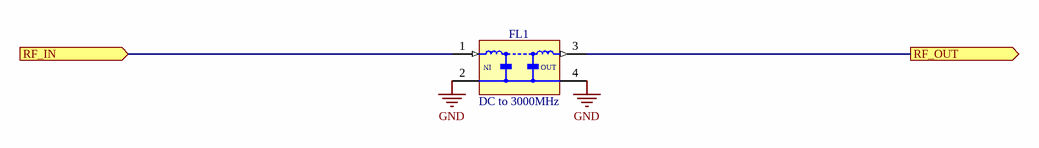
[diagram p6: ADC_Filter.SchDoc]

### Parts
FL1  DC to 3000MHz  [FIL_MINI-CIRCUITS_FV1206]

### Ports
RF_IN (in), RF_OUT (out)

### Nets
GND: FL1.2(GND) FL1.4(GND)
NetFL1_1: FL1.1(RFIN) ; port RF_IN
NetFL1_3: FL1.3(RFOUT) ; port RF_OUT

### Notes on the sheet
- Project/Equipment
- Designer
- Drawn by
- Check.by
- File
- Last Mod.
- Print Date
- Sheet
- Size
- A3
- of
- Rev
- (in symbol FIL_MINI-CIRCUITS_LFCN-3000+) IN; OUT

### Library data of the parts
FL1 = FIL_MINI-CIRCUITS_LFCN-3000+: as FL2 on sheet DAC_Filter; Part Number: FIL_MINI-CIRCUITS_LFCN-3000+; Component Kind: Standard; Component Type: Standard; Pin Count: 2; Value: DC to 3000MHz; Status: None; Manufacturer: MINI-CIRCUITS; Manufacturer Part Number: LFCN-3000+; Mounted: Yes; Socket: No; SMD: Yes; Sense: No; ComponentHeight: 0.94mm; HelpURL: \\cern.ch\dfs\Applications\Altium\Datasheets\FIL_MINI-CIRCUITS_LFCN-3000+.pdf; Author: CERN DEM JLC; CreateDate: 2013-12-09; LatestRevisionDate: 2013-12-09

## Nets that join several sheets
GND: U_DAC_channel1/U_DAC_Filter (6 pins), U_DAC_channel2/U_DAC_Filter (6 pins), B2B_connectors  (17 pins), ADC_Buffer (10 pins), ADC_Filter (FL1.2 FL1.4)
NetC36A_2: U_DAC_channel1/U_Amplifier (C36A.2), U_DAC_channel1/U_DAC_Filter (FL4A.3)
NetC36B_2: U_DAC_channel2/U_Amplifier (C36B.2), U_DAC_channel2/U_DAC_Filter (FL4B.3)